# EAGLE design Garagentor (EAGLE 9.6.2)
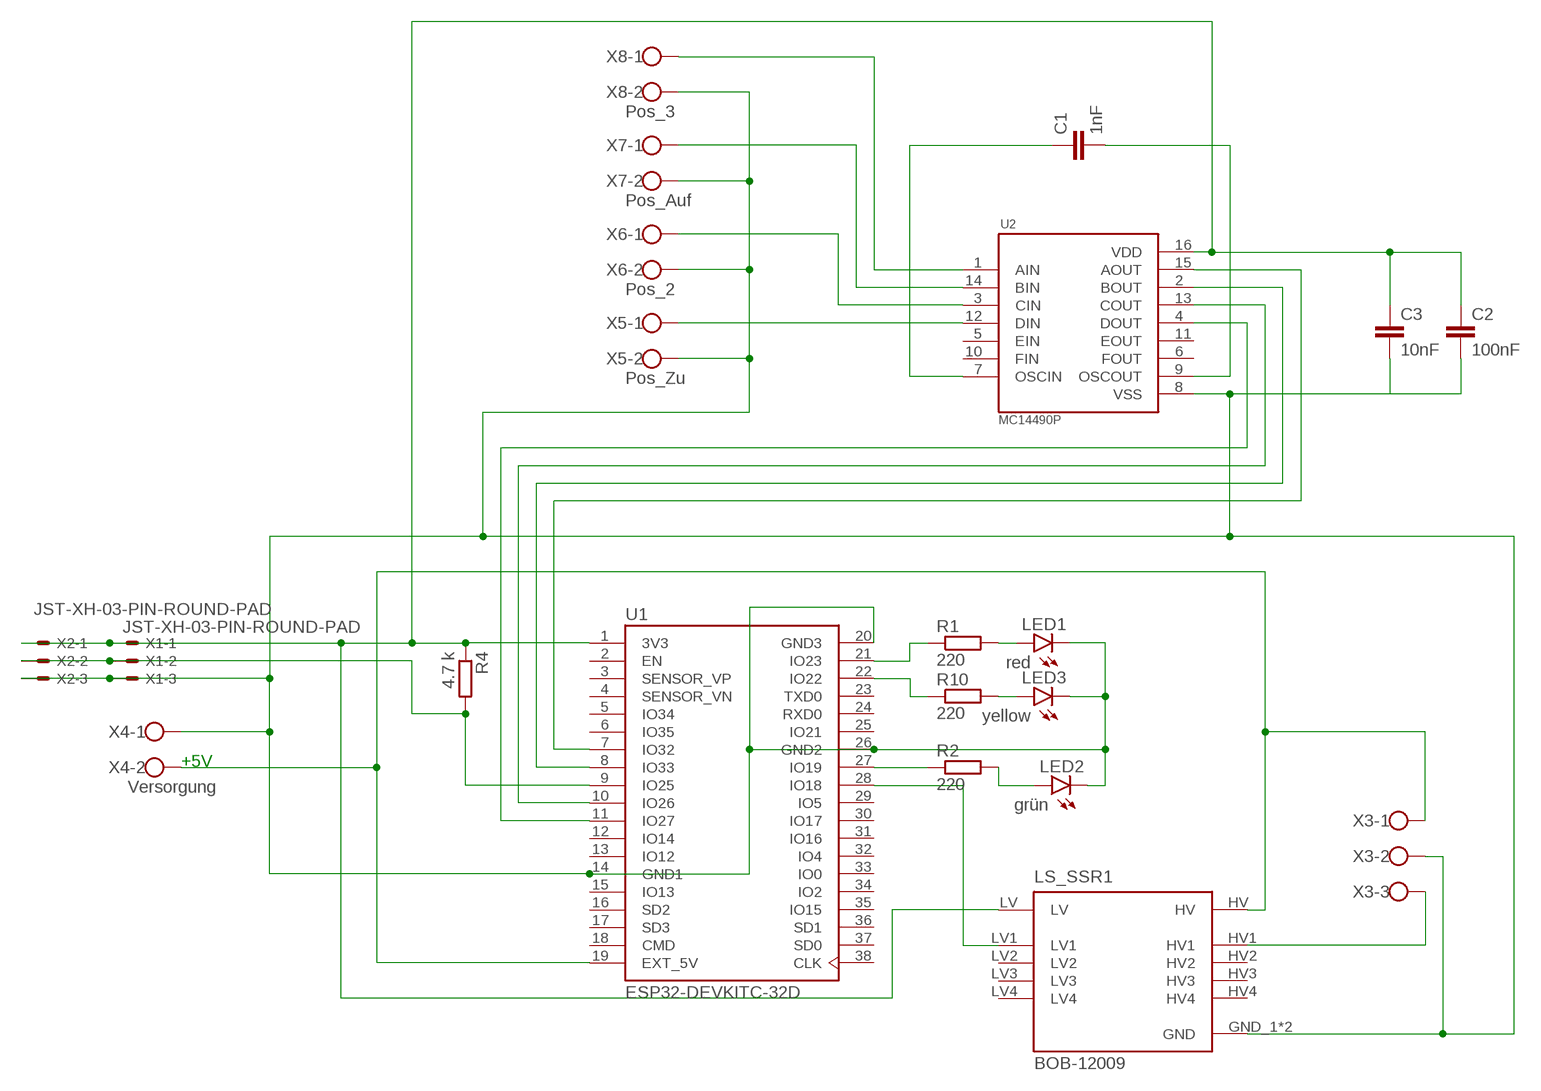
[diagram p0: schematic, sheet 1]

## Parts
C1  1nF  C-EU050-024X044  [C050-024X044]
C2  100nF  C-EU050-024X044  [C050-024X044]
C3  10nF  C-EU050-024X044  [C050-024X044]
LED1  red  LED3MM  [LED3MM]
LED2  grün  LED3MM  [LED3MM]
LED3  yellow  LED3MM  [LED3MM]
LS_SSR1  BOB-12009  [CONV_BOB-12009]
R1  220  R-EU_0204/7  [0204/7]
R2  220  R-EU_0204/7  [0204/7]
R4  4.7 k  R-EU_0204/7  [0204/7]
R10  220  R-EU_0204/7  [0204/7]
U1  ESP32-DEVKITC-32D  [MODULE_ESP32-DEVKITC-32D]
U2  MC14490P  [DIP762W46P254L1918H444Q16P]
X1  JST-XH-03-PIN-ROUND-PAD  [JST-XH-03-PACKAGE-ROUND-PAD]
X2  JST-XH-03-PIN-ROUND-PAD  [JST-XH-03-PACKAGE-ROUND-PAD]
X3  W237-103  [W237-103]
X4  Versorgung  W237-102  [W237-102]
X5  Pos_Zu  W237-102  [W237-102]
X6  Pos_2  W237-102  [W237-102]
X7  Pos_Auf  W237-102  [W237-102]
X8  Pos_3  W237-102  [W237-102]

## Nets
GND$1: C2.2 C3.2 LED1.K(C) LED2.K(C) LED3.K(C) LS_SSR1.GND_1(GND) LS_SSR1.GND_2(GND) U1.14(GND1) U1.20(GND3) U1.26(GND2) U2.8(VSS) X1.3 X2.3 X3.2 X4.1 X5.2 X6.2 X7.2 X8.2
N$1: R1.1 U1.21(IO23)
N$2: U1.7(IO32) U2.15(AOUT)
N$3: R10.1 U1.22(IO22)
N$4: LED3.A R10.2
N$5: LS_SSR1.HV1 X3.3
N$6: R2.1 U1.27(IO19)
N$7: LED1.A R1.2
N$8: LED2.A R2.2
N$9: U1.8(IO33) U2.2(BOUT)
N$10: U1.10(IO26) U2.13(COUT)
N$11: R4.2 U1.9(IO25) X1.2 X2.2
N$12: U1.11(IO27) U2.4(DOUT)
N$13: U2.1(AIN) X8.1
N$14: U2.14(BIN) X7.1
N$15: U2.3(CIN) X6.1
N$16: LS_SSR1.LV1 U1.28(IO18)
N$17: U2.12(DIN) X5.1
N$18: C1.1 U2.7(OSCIN)
N$19: C1.2 U2.9(OSCOUT)
VDD3$13: C2.1 C3.1 LS_SSR1.LV R4.1 U1.1(3V3) U2.16(VDD) X1.1 X2.1
VDD5$3: LS_SSR1.HV U1.19(EXT_5V) X3.1 X4.2
Unconnected: LS_SSR1.HV2 LS_SSR1.HV3 LS_SSR1.HV4 LS_SSR1.LV2 LS_SSR1.LV3 LS_SSR1.LV4 U1.2(EN) U1.3(SENSOR_VP) U1.4(SENSOR_VN) U1.5(IO34) U1.6(IO35) U1.12(IO14) U1.13(IO12) U1.15(IO13) U1.16(SD2) U1.17(SD3) U1.18(CMD) U1.23(TXD0) U1.24(RXD0) U1.25(IO21) U1.29(IO5) U1.30(IO17) U1.31(IO16) U1.32(IO4) U1.33(IO0) U1.34(IO2) U1.35(IO15) U1.36(SD1) U1.37(SD0) U1.38(CLK) U2.5(EIN) U2.6(FOUT) U2.10(FIN) U2.11(EOUT)

## Notes on the sheet
- +5V

## Library data of the parts
C1-C3 = rcl:C-EU: CAPACITOR, European symbol; SPICEPREFIX: C
LED1-LED3 = led:LED: LED OSRAM: - CHIPLED LG R971, LG N971, LY N971, LG Q971, LY Q971, LO R971, LY R971 LH N974, LH R974 LS Q976, LO Q976, LY Q976 LO Q996 - Hyper CHIPLED LW Q18S LB Q993, LB Q99A, LB R99A - SideLED LS A670, LO A670, LY A670, LG A670, LP A670 LB A673, LV A673, LT A673, LW A673 LH A674 LY A675 LS A676, LA A676, LO A676, LY A676, LW A676 LS A679, LY A679, LG A679 - Hyper Micro SIDELED® LS Y876, LA Y876, LO Y876, LY Y876 LT Y87S - SmartLED LW L88C, LW L88S LB L89C, LB L89S, LG L890 LS L89K, LO L89K, LY L89K LS L896, LA L896, LO L896, LY L896 - TOPLED LS T670, LO T670, LY T670, LG T670, LP T670 LSG T670, LSP T670, LSY T670, LOP T670, LYG T670 LG T671, LOG T671, LSG T671 LB T673, LV T673, LT T673, LW T673 LH T674 LS T676, LA T676, LO T676, LY T676, LB T676, LH T676, LSB T676, LW T676 LB T67C, LV T67C, LT T67C, LS T67K, LO T67K, LY T67K, LW E67C LS E67B, LA E67B, LO E67B, LY E67B, LB E67C, LV E67C, LT E67C LW T67C LS T679, LY T679, LG T679 LS T770, LO T770, LY T770, LG T770, LP T770 LB T773, LV T773, LT T773, LW T773 LH T774 LS E675, LA E675, LY E675, LS T675 LS T776, LA T776, LO T776, LY T776, LB T776 LHGB T686 LT T68C, LB T68C - Hyper Mini TOPLED® LB M676 - Mini TOPLED Santana® LG M470 LS M47K, LO M47K, LY M47K Source: http://www.osram.convergy.de LUXEON: - LUMILED® LXK2-PW12-R00, LXK2-PW12-S00, LXK2-PW14-U00, LXK2-PW14-V00 LXK2-PM12-R00, LXK2-PM12-S00, LXK2-PM14-U00 LXK2-PE12-Q00, LXK2-PE12-R00, LXK2-PE12-S00, LXK2-PE14-T00, LXK2-PE14-U00 LXK2-PB12-K00, LXK2-PB12-L00, LXK2-PB12-M00, LXK2-PB14-N00, LXK2-PB14-P00, LXK2-PB14-Q00 LXK2-PR12-L00, LXK2-PR12-M00, LXK2-PR14-Q00, LXK2-PR14-R00 LXK2-PD12-Q00, LXK2-PD12-R00, LXK2-PD12-S00 LXK2-PH12-R00, LXK2-PH12-S00 LXK2-PL12-P00, LXK2-PL12-Q00, LXK2-PL12-R00 Source: www.luxeon.com KINGBRIGHT: KA-3528ASYC Source: www.kingbright.com
LS_SSR1 = BOB-12009:BOB-12009: Logic Level Converter - Bi-Direc Check availability <https://pricing.snapeda.com/parts/BOB-12009/SparkFun/view-part?ref=eda>; AVAILABILITY: In Stock; DESCRIPTION: BSS138 Logic-Level Translator Interface Evaluation Board; MF: SparkFun; MP: BOB-12009; PACKAGE: None; PRICE: None; PURCHASE-URL: https://pricing.snapeda.com/search?q=BOB-12009&ref=eda
R1 R2 R4 R10 = rcl:R-EU_: RESISTOR, European symbol; SPICEPREFIX: R
U1 = ESP32-DEVKITC-32D:ESP32-DEVKITC-32D: Eval Board For Esp-Wroom-32 Check availability <https://pricing.snapeda.com/parts/ESP32-DEVKITC-32D/Espressif%20Systems/view-part?ref=eda>; AVAILABILITY: In Stock; DESCRIPTION: WiFi Development Tools (802.11) ESP32 General Development Kit, ESP32-WROOM-32D on the board; MF: Espressif Systems; MP: ESP32-DEVKITC-32D; PACKAGE: None; PRICE: None; PURCHASE-URL: https://pricing.snapeda.com/search/part/ESP32-DEVKITC-32D/?ref=eda
U2 = MC14490P:MC14490P: Hex Contact Bounce Eliminator Check availability <https://pricing.snapeda.com/parts/MC14490P/onsemi/view-part?ref=eda>; AVAILABILITY: In Stock; CHECK_PRICES: https://www.snapeda.com/parts/MC14490P/Onsemi/view-part/?ref=eda; DESCRIPTION: IC ELIMINATOR BOUNCE HEX 16DIP; MF: onsemi; MP: MC14490P; PACKAGE: None; PRICE: None; SNAPEDA_LINK: https://www.snapeda.com/parts/MC14490P/Onsemi/view-part/?ref=snap
X1 X2 = Rembrandt Electronics - JST XH Connectors v1-0:JST-XH-03-PIN: JST XH Connector 2 Pin Wire to board connector. Pitch: 2,54 mm, (0.100") Number of pins: 3 Created by Rembrandt Electronics www.rembrandtelectronics.com
X3 = con-wago-500:W237-103: WAGO SCREW CLAMP; MPN: 237-103; OC_FARNELL: unknown; OC_NEWARK: 18M7116
X4-X8 = con-wago-500:W237-102: WAGO SCREW CLAMP; MPN: 237-102; OC_FARNELL: unknown; OC_NEWARK: 70K9898

## Board
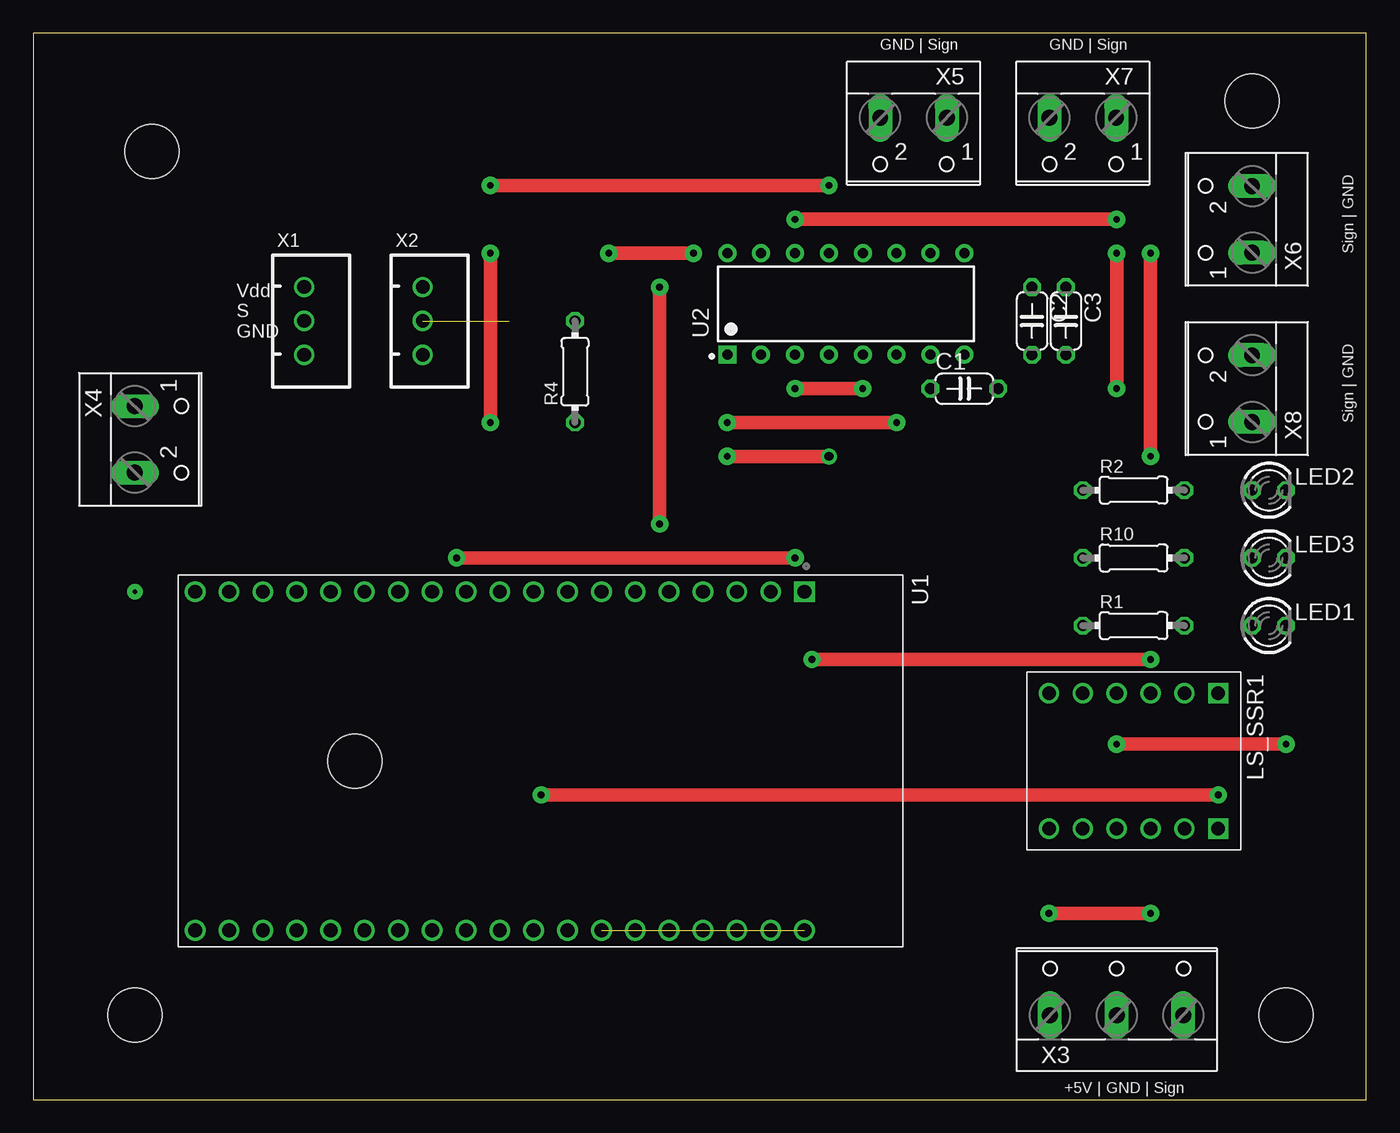
[diagram p1: board, top side]
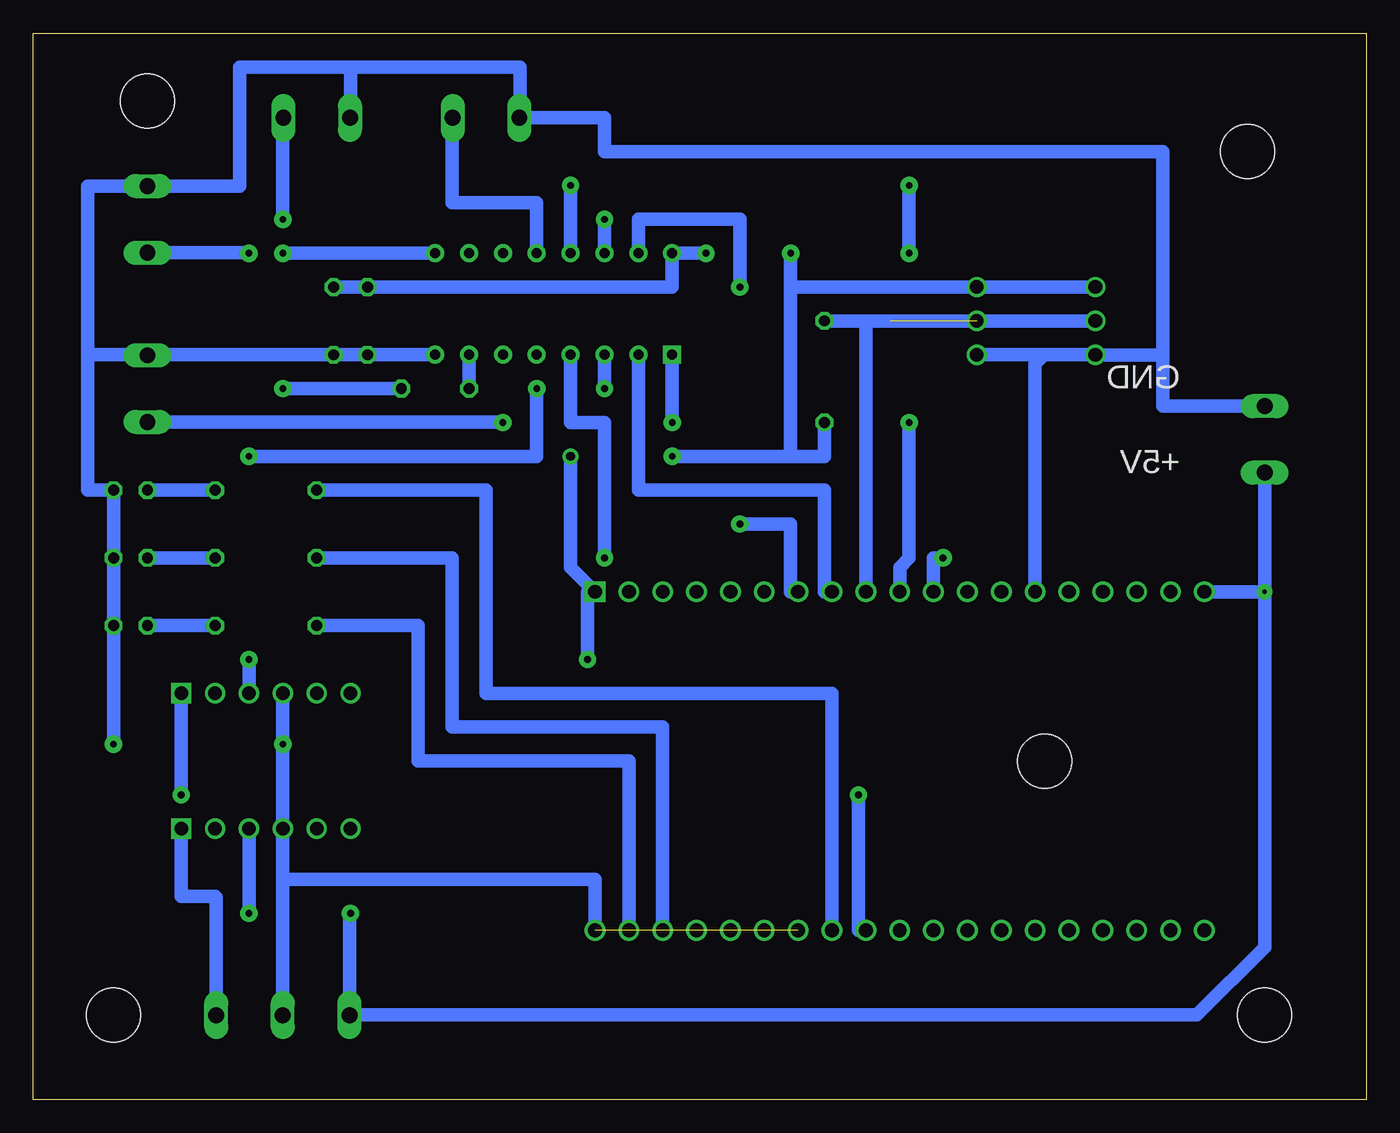
[diagram p2: board, bottom side, seen from below]

Size 100 x 80 mm. Coordinates in mm from the lower left corner, seen from the top.
Outline: 0,0 100,0 100,80 0,80 0,0
Copper layers (1*16): Top 0.035mm / dielectric 1.5mm / Bottom 0.035mm
Design rules "default": minimum track width 6mil, minimum drill 0.35mm, track to track 6mil, track to pad 6mil, pad to pad 6mil, via to via 6mil, smd to smd 6mil, copper to edge 40mil, drill to drill 6mil, minimum pad ring 10mil, minimum via ring 8mil, stop-mask expansion 4mil, vias tented up to drill 0mil, thermal gap 10mil
Holes 4.06 mm at 8.89,71.12 91.44,74.93 93.98,6.35 7.62,6.35 24.13,25.4

### Footprints (pad centres in the part's own frame; a part is rotated, then mirrored left to right if it is on the bottom)
C050-024X044 = drill 0.813 octagon: 1 -2.54,0; 2 2.54,0
LED3MM = drill 0.813 octagon: A -1.27,0; K 1.27,0
CONV_BOB-12009 = drill 1.016: GND_1 5.08,-1.27; GND_2 -5.08,-1.27; HV 5.08,1.27; HV2 5.08,3.81; HV3 5.08,-3.81; HV4 5.08,-6.35; LV -5.08,1.27; LV2 -5.08,3.81; LV3 -5.08,-3.81; LV4 -5.08,-6.35 | drill 1.016 square: HV1 5.08,6.35; LV1 -5.08,6.35
0204/7 = drill 0.813 octagon: 1 -3.81,0; 2 3.81,0
MODULE_ESP32-DEVKITC-32D = drill 1.04 square: 1 -12.7,19.76 | drill 1.04: 2 -12.7,17.22; 3 -12.7,14.68; 4 -12.7,12.14; 5 -12.7,9.6; 6 -12.7,7.06; 7 -12.7,4.52; 8 -12.7,1.98; 9 -12.7,-0.56; 10 -12.7,-3.1; 11 -12.7,-5.64; 12 -12.7,-8.18; 13 -12.7,-10.72; 14 -12.7,-13.26; 15 -12.7,-15.8; 16 -12.7,-18.34; 17 -12.7,-20.88; 18 -12.7,-23.42; 19 -12.7,-25.96; 20 12.7,19.76; 21 12.7,17.22; 22 12.7,14.68; 23 12.7,12.14; 24 12.7,9.6; 25 12.7,7.06; 26 12.7,4.52; 27 12.7,1.98; 28 12.7,-0.56; 29 12.7,-3.1; 30 12.7,-5.64; 31 12.7,-8.18; 32 12.7,-10.72; 33 12.7,-13.26; 34 12.7,-15.8; 35 12.7,-18.34; 36 12.7,-20.88; 37 12.7,-23.42; 38 12.7,-25.96
DIP762W46P254L1918H444Q16P = drill 0.75 pad 1.35 square: 1 -3.81,8.89 | drill 0.75 pad 1.35: 2 -3.81,6.35; 3 -3.81,3.81; 4 -3.81,1.27; 5 -3.81,-1.27; 6 -3.81,-3.81; 7 -3.81,-6.35; 8 -3.81,-8.89; 9 3.81,-8.89; 10 3.81,-6.35; 11 3.81,-3.81; 12 3.81,-1.27; 13 3.81,1.27; 14 3.81,3.81; 15 3.81,6.35; 16 3.81,8.89
JST-XH-03-PACKAGE-ROUND-PAD = drill 1.016: 1 -2.54,0; 2 0,0; 3 2.54,0
W237-103 = drill 1.194 long: 1 -5,-1.29; 2 0,-1.29; 3 5,-1.29
W237-102 = drill 1.194 long: 1 -2.5,-1.27; 2 2.5,-1.27

### Placement (x,y rotation side)
C1  69.85,53.34 0 top
C2  74.93,58.42 270 top
C3  77.47,58.42 270 top
LED1  92.71,35.56 0 top
LED2  92.71,45.72 0 top
LED3  92.71,40.64 0 top
LS_SSR1  82.55,25.4 270 top
R1  82.55,35.56 0 top
R2  82.55,45.72 0 top
R4  40.64,54.61 90 top
R10  82.55,40.64 0 top
U1  38.1,25.4 270 top
U2  60.96,59.69 90 top
X1  20.32,58.42 270 top
X2  29.21,58.42 270 top
X3  81.28,7.62 0 top
X4  8.89,49.53 270 top
X5  66.04,72.39 180 top
X6  90.17,66.04 90 top
X7  78.74,72.39 180 top
X8  90.17,53.34 90 top

### Tracks (layer width: path | path; a pad name or v marks a point on that pad's centre or on a via)
GND$1  (via drill 0.51 pad 1.3)  (1 unrouted)
  Top 1.016: v93.98,26.67 v81.28,26.67
  Bottom 1.016: X2.3 X1.3 | X3.2 81.28,16.51 | 81.28,16.51 LS_SSR1.GND_1 v81.28,26.67 LS_SSR1.GND_2 | U1.20 57.86,16.51 81.28,16.51 | X1.3 24.13,55.88 24.84,55.17 U1.14 | X1.3 20.32,55.84 15.24,55.84 | X4.1 15.24,52.03 15.24,55.84 | U2.8 C2.2 C3.2 91.44,55.88 | v93.98,26.67 LED1.K LED3.K LED2.K 95.94,45.72 95.94,55.88 | X8.2 91.44,55.88 | 91.44,55.88 95.94,55.88 | 95.94,55.88 95.94,68.54 X6.2 84.51,68.54 84.51,77.47 76.2,77.47 | X7.2 76.2,73.66 76.2,77.47 | 76.2,77.47 63.5,77.47 63.5,73.66 | 63.5,73.66 X5.2 | 15.24,55.84 15.24,71.12 57.15,71.12 57.15,73.66 63.5,73.66
N$1
  Bottom 1.016: R1.1 71.12,35.56 71.12,25.4 55.32,25.4 U1.21
N$2  (via drill 0.51 pad 1.3)
  Top 1.016: v46.99,43.18 v46.99,60.96
  Bottom 1.016: U1.7 43.18,38.1 43.18,43.18 v46.99,43.18 | U2.15 54.61,66.04 46.99,66.04 v46.99,60.96
N$3
  Bottom 1.016: R10.1 68.58,40.64 68.58,27.94 52.78,27.94 U1.22
N$4
  Bottom 1.016: R10.2 LED3.A
N$5
  Bottom 1.016: X3.3 86.28,15.16 86.36,15.24 88.9,15.24 LS_SSR1.HV1
N$6
  Bottom 1.016: R2.1 66.04,45.72 66.04,30.48 40.08,30.48 U1.27
N$7
  Bottom 1.016: R1.2 LED1.A
N$8
  Bottom 1.016: R2.2 LED2.A
N$9
  Bottom 1.016: 54.61,53.34 U2.2 54.61,45.72 40.64,45.72 40.64,38.1 U1.8
N$10  (via drill 0.51 pad 1.3)
  Top 1.016: v59.69,68.58 v34.29,68.58 | v34.29,63.5 v34.29,50.8
  Bottom 1.016: U2.13 v59.69,68.58 | v34.29,68.58 v34.29,63.5 | v34.29,50.8 34.29,40.64 35,39.93 U1.10
N$11  (1 unrouted)
  Bottom 1.016: X1.2 X2.2 37.54,58.42 U1.9 | 35.7,58.42 R4.2
N$12  (via drill 0.51 pad 1.3)
  Top 1.016: v57.15,40.64 v31.75,40.64
  Bottom 1.016: U2.4 59.69,50.8 57.15,50.8 v57.15,40.64 | U1.11 32.46,40.64 v31.75,40.64
N$13  (via drill 0.51 pad 1.3)
  Top 1.016: v52.07,50.8 v64.77,50.8
  Bottom 1.016: U2.1 v52.07,50.8 | v64.77,50.8 64.77,50.84 X8.1
N$14  (via drill 0.51 pad 1.3)
  Top 1.016: v57.15,66.04 v81.28,66.04
  Bottom 1.016: U2.14 v57.15,66.04 | 81.24,73.62 X7.1 81.28,73.62 v81.28,66.04
N$15  (via drill 0.51 pad 1.3)
  Top 1.016: v57.15,53.34 v62.23,53.34 | v83.82,63.5 v83.82,48.26
  Bottom 1.016: U2.3 v57.15,53.34 | v62.23,53.34 62.23,48.26 v83.82,48.26 | v83.82,63.5 83.82,63.54 X6.1
N$16  (via drill 0.51 pad 1.3)
  Top 1.016: v88.9,22.86 v38.1,22.86
  Bottom 1.016: LS_SSR1.LV1 v88.9,22.86 | v38.1,22.86 38.1,12.7 U1.28
N$17
  Bottom 1.016: U2.12 62.23,67.31 68.58,67.31 68.58,73.66 X5.1
N$18
  Bottom 1.016: C1.1 U2.7
N$19  (via drill 0.51 pad 1.3)
  Top 1.016: v81.28,63.5 v81.28,53.34
  Bottom 1.016: C1.2 v81.28,53.34 | v81.28,63.5 U2.9
VDD3$13  (via drill 0.51 pad 1.3, 0.65 pad 1.2)
  Top 1.016: v83.82,33.02 v58.42,33.02 | v49.53,63.5 v43.18,63.5 | v59.69,48.26 v52.07,48.26
  Bottom 1.016: X1.1 X2.1 43.18,60.96 | R4.1 40.64,48.26 43.18,48.26 | v59.69,48.26 59.69,39.93 U1.1 58.42,38.1 v58.42,33.02 | LS_SSR1.LV v83.82,33.02 | v43.18,63.5 43.18,60.96 | C3.1 C2.1 52.07,60.96 U2.16 v49.53,63.5 | v52.07,48.26 43.18,48.26 | 43.18,60.96 43.18,48.26
VDD5$3  (via drill 0.35 pad 1.15, 0.51 pad 1.3)
  Top 1.016: v83.82,13.97 v76.2,13.97
  Bottom 1.016: v7.62,38.1 X4.2 7.62,46.99 | U1.19 v7.62,38.1 | v7.62,38.1 7.62,11.43 12.7,6.35 76.26,6.35 X3.1 76.28,13.89 v76.2,13.97 | LS_SSR1.HV v83.82,13.97

### Text on the board
tPlace: GND | Sign | GND | Sign | Sign | GND | Sign | GND | +5V | GND | Sign
tNames: Vdd / S / GND
bNames: GND | +5V